# Altium schematic sheet Preamp.SchDoc
size A
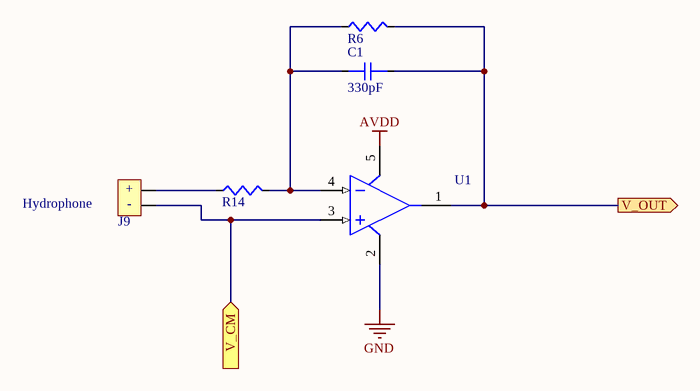
[diagram p0: Preamp.SchDoc]

## Parts
C1  330pF  [C0603]
J9  J  [hydrophones_sma_conn]  (value not drawn)
R6  1M  [R0603]  (value not drawn)
R14  330  [R0603]  (value not drawn)
U1  OPA325  [SOT-23-5]  (value not drawn)

## Ports
V_CM (in), V_OUT (out)

## Nets
AVDD: U1.5(VS+)
GND: U1.2(VS-)
V_CM: J9.2 U1.3(+IN) ; port V_CM
V_OUT: C1.2 R6.2 U1.1(OUT) ; port V_OUT
NetC1_1: C1.1 R6.1 R14.2 U1.4(-IN)
NetJ9_1: J9.1 R14.1

## Notes on the sheet
- (near J9) Hydrophone
- (in symbol hydrophone_connector) +; -

## Library data of the parts
C1 = CC0603KRX7R9BB331: CAP CER 330PF 50V X7R 0603; Tolerance: 10%; Insulation Resistance: 10GR; Dissipation Factor: 2.5%; RoHS: Yes; Mount: Surface Mount; Case/Package: 0603; Case Code (Imperial): 0603; Case Code (Metric): 1608; Min Operating Temperature: -55°C; Max Operating Temperature: 125°C; Capacitance: 330pF; Dielectric: X7R; Package Quantity: 1; Voltage Rating: 50V; Voltage Rating (DC): 50V; Packaging: Tape and Reel; Termination: SMD/SMT; Composition: Ceramic; Length: 1.6mm; Height: 0.8mm; Depth: 0.8mm; Width: 0.8mm; Thickness: 0.035inch; Radiation Hardening: No; REACH SVHC: Unknown; Lead Free: Lead Free; Halogen Free: Halogen Free; ComponentLink1URL: https://datasheet.ciiva.com/8033/1489800-8033879.pdf?src-supplier=Element14; ComponentLink1Description: https://datasheet.ciiva.com/8033/1489800-8033879.pdf?src-supplier=Element14; ComponentLink2URL: https://datasheet.ciiva.com/17434/upy-gphc-x7r-6-3v-to-50v-8-17434663.pdf?src-supplier=Avnet+Europe; ComponentLink2Description: https://datasheet.ciiva.com/17434/upy-gphc-x7r-6-3v-to-50v-8-17434663.pdf?src-supplier=Avnet+Europe; ComponentLink3URL: https://datasheet.ciiva.com/144/mlccorderingcode-144456.pdf?src-supplier=Digi-Key; ComponentLink3Description: https://datasheet.ciiva.com/144/mlccorderingcode-144456.pdf?src-supplier=Digi-Key; ComponentLink4URL: https://datasheet.ciiva.com/144/mlccorderingcode-144454.pdf?src-supplier=Digi-Key; ComponentLink4Description: https://datasheet.ciiva.com/144/mlccorderingcode-144454.pdf?src-supplier=Digi-Key; ComponentLink5URL: https://datasheet.ciiva.com/144/mlccorderingcode-144455.pdf?src-supplier=Digi-Key; ComponentLink5Description: https://datasheet.ciiva.com/144/mlccorderingcode-144455.pdf?src-supplier=Digi-Key; ComponentLink6URL: https://datasheet.ciiva.com/11465/upy-gphc-x7r-6-3v-to-50v-8-11465240.pdf?src-supplier=Avnet; ComponentLink6Description: https://datasheet.ciiva.com/11465/upy-gphc-x7r-6-3v-to-50v-8-11465240.pdf?src-supplier=Avnet; ComponentLink7URL: https://datasheet.ciiva.com/8033/1489800-8033881.pdf?src-supplier=Element14; ComponentLink7Description: https://datasheet.ciiva.com/8033/1489800-8033881.pdf?src-supplier=Element14; ComponentLink8URL: https://datasheet.ciiva.com/7978/1489800-7978174.pdf?src-supplier=Element14; ComponentLink8Description: https://datasheet.ciiva.com/7978/1489800-7978174.pdf?src-supplier=Element14; Supplier 1: Digi-Key; Supplier Part Number 1: 311-1186-1-ND
J9 = hydrophone_connector: Supplier 1: Digi-Key; Supplier Part Number 1: WM8552-ND
R6 = MCT06030C1004FP500: RES SMD 1M OHM 1% 1/8W 0603; Manufacturer 1: Vishay Beyschlag; Resistance: 1MR; Power Rating: 100mW; Voltage Rating: 75V; Max Power Dissipation: 125mW; Temperature Coefficient: 50ppm/°C; Supplier 1: Digi-Key; Supplier Part Number 1: MCT0603-1.00M-CFCT-ND; Manufacturer Part Number 1: MCT06030C1004FP500; Stock 1: 189743; Pricing 1: 1=0.18000, 10=0.15200, 100=0.05960, 1000=0.02495, 2500=0.02287 (USD); RoHS: Yes; Mount: Surface Mount; Case/Package: 0603; Weight: 7.1E-05oz; Case Code (Metric): 1608; Case Code (Imperial): 0603; Contact Plating: Tin; Min Operating Temperature: -55°C; Max Operating Temperature: 125°C; Package Quantity: 1; Tolerance: 1%; Packaging: Tape and Reel; Composition: Thin Film; Number of Terminations: 2; Termination: SMD/SMT; Military Standard: Not; Voltage Rating (DC): 75V; Length: 0.061inch; Height: 0.022inch; Width: 0.033inch; Depth: 0.85mm; Radiation Hardening: No; REACH SVHC: Unknown; Lead Free: Lead Free; ComponentLink1URL: https://datasheet.ciiva.com/2470/mc-pro-2470384.pdf?src-supplier=Digi-Key; ComponentLink1Description: https://datasheet.ciiva.com/2470/mc-pro-2470384.pdf?src-supplier=Digi-Key; ComponentLink2URL: https://datasheet.ciiva.com/2470/mc-pro-2470385.pdf?src-supplier=Digi-Key; ComponentLink2Description: https://datasheet.ciiva.com/2470/mc-pro-2470385.pdf?src-supplier=Digi-Key; ComponentLink3URL: https://datasheet.ciiva.com/2470/mc-pro-2470386.pdf?src-supplier=Digi-Key; ComponentLink3Description: https://datasheet.ciiva.com/2470/mc-pro-2470386.pdf?src-supplier=Digi-Key; ComponentLink4URL: https://datasheet.ciiva.com/9112/mc-pro-9112535.pdf?src-supplier=Avnet; ComponentLink4Description: https://datasheet.ciiva.com/9112/mc-pro-9112535.pdf?src-supplier=Avnet; ComponentLink5URL: https://datasheet.ciiva.com/16893/mc-pro-16893006.pdf?src-supplier=Avnet+Europe; ComponentLink5Description: https://datasheet.ciiva.com/16893/mc-pro-16893006.pdf?src-supplier=Avnet+Europe
R14 = MCT06030C3300FP500: RES SMD 330 OHM 1% 1/8W 0603; Manufacturer 1: Vishay Beyschlag; Resistance: 330R; Power Rating: 125mW; Voltage Rating: 75V; Temperature Coefficient: 50ppm/°C; Supplier 1: Digi-Key; Supplier Part Number 1: MCT0603-330-CFCT-ND; Manufacturer Part Number 1: MCT06030C3300FP500; Stock 1: 133742; Pricing 1: 1=0.18000, 10=0.15200, 100=0.05960, 1000=0.02495, 2500=0.02287 (USD); RoHS: Yes; Case/Package: 0603; Case Code (Metric): 1608; Case Code (Imperial): 0603; Contact Plating: Tin; Min Operating Temperature: -55°C; Max Operating Temperature: 125°C; Package Quantity: 1; Tolerance: 1%; Packaging: Tape and Reel; Composition: Thin Film; Number of Terminations: 2; Military Standard: Not; Max Power Dissipation: 125mW; Voltage Rating (DC): 75V; Length: 0.061inch; Height: 0.022inch; Width: 0.033inch; Depth: 0.85mm; Radiation Hardening: No; REACH SVHC: No SVHC; Lead Free: Lead Free; ComponentLink1URL: https://datasheet.ciiva.com/2470/mc-pro-2470441.pdf?src-supplier=Digi-Key; ComponentLink1Description: https://datasheet.ciiva.com/2470/mc-pro-2470441.pdf?src-supplier=Digi-Key; ComponentLink2URL: https://datasheet.ciiva.com/2470/mc-pro-2470442.pdf?src-supplier=Digi-Key; ComponentLink2Description: https://datasheet.ciiva.com/2470/mc-pro-2470442.pdf?src-supplier=Digi-Key; ComponentLink3URL: https://datasheet.ciiva.com/2470/mc-pro-2470443.pdf?src-supplier=Digi-Key; ComponentLink3Description: https://datasheet.ciiva.com/2470/mc-pro-2470443.pdf?src-supplier=Digi-Key; ComponentLink4URL: https://datasheet.ciiva.com/16892/mc-pro-16892683.pdf?src-supplier=Avnet+Europe; ComponentLink4Description: https://datasheet.ciiva.com/16892/mc-pro-16892683.pdf?src-supplier=Avnet+Europe; ComponentLink5URL: https://datasheet.ciiva.com/8898/mc-pro-8898943.pdf?src-supplier=Avnet; ComponentLink5Description: https://datasheet.ciiva.com/8898/mc-pro-8898943.pdf?src-supplier=Avnet
U1 = OPA325IDBVR: Manufacturer 1: Texas Instruments; Supplier 1: Digi-Key; Supplier Part Number 1: 296-OPA325IDBVRCT-ND; Manufacturer Part Number 1: OPA325IDBVR; Stock 1: 2034; Pricing 1: 1=1.69000, 10=1.51600, 25=1.43000, 100=1.14400, 250=1.00100, 500=0.97240, 1000=0.77220 (USD); RoHS: No